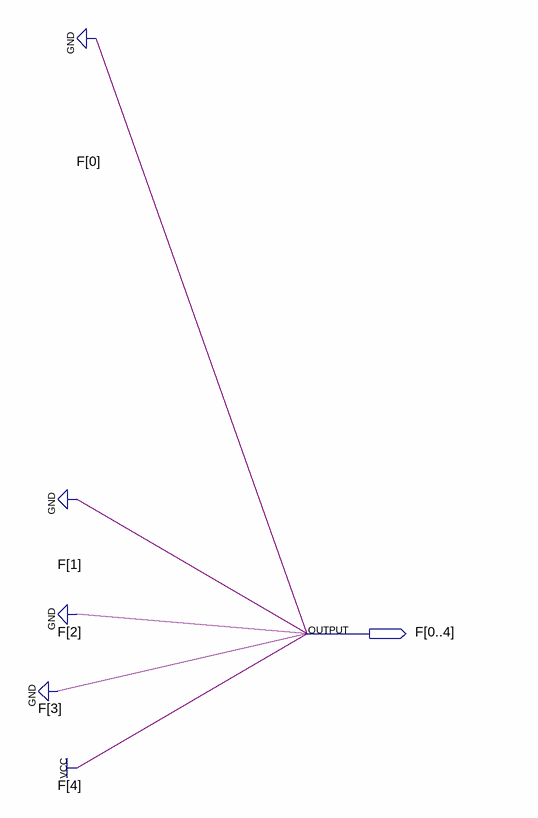
[diagram p0: schematic sheet]
// Quartus schematic const1.bdf as structural Verilog: 0 symbols, 1 pins
module const1 (
  output [0:4] F
);


  assign F = {5{1'b1}};
endmodule
